# EAGLE design BigBoard (EAGLE 6.5.0)
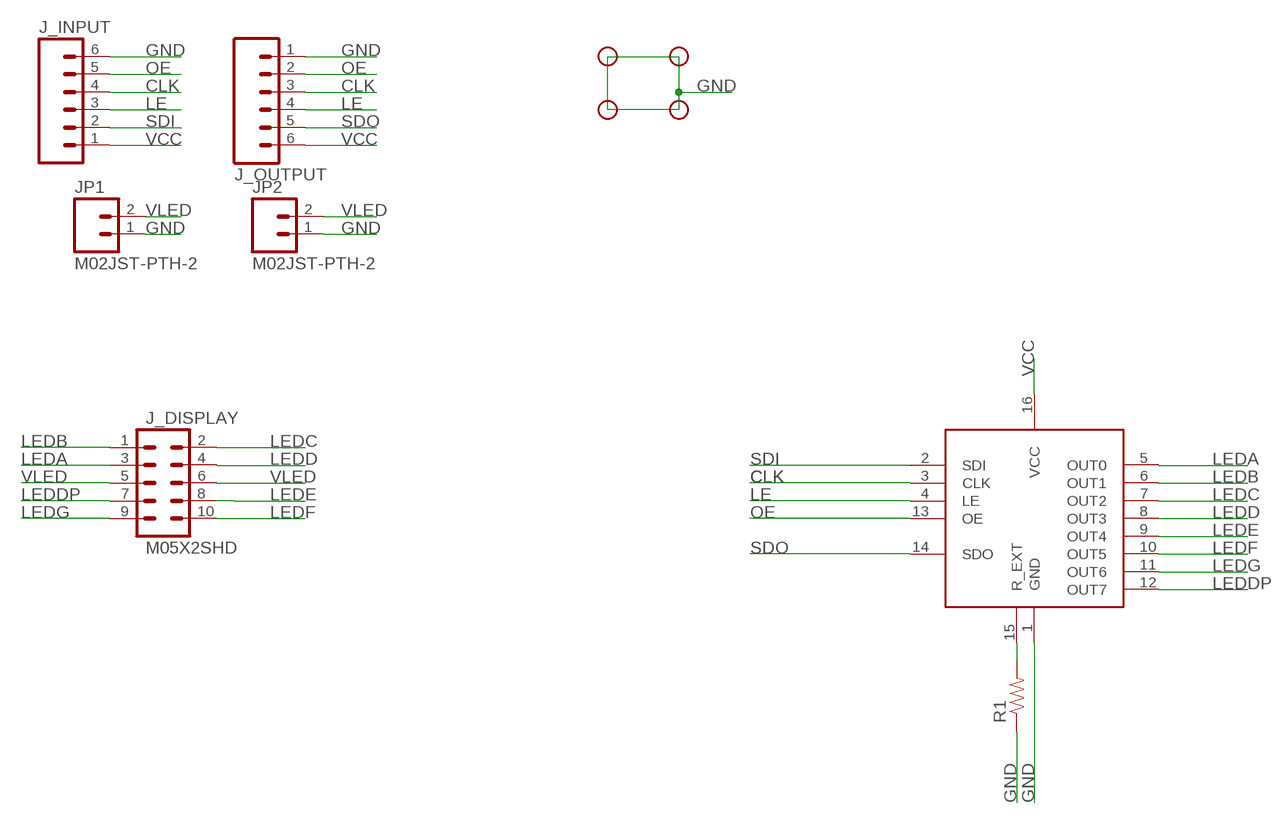
[diagram p0: schematic, sheet 1]

## Parts
J_DISPLAY  M05X2SHD  [2X5-SHROUDED]
J_INPUT  M06POLAR  [MOLEX-1X6]
J_OUTPUT  M06POLAR  [MOLEX-1X6]
JP1  M02JST-PTH-2  [JST-2-PTH]
JP2  M02JST-PTH-2  [JST-2-PTH]
R1  RESISTOR0603-RES  [0603-RES]
STANDOFF1  STAND-OFF  [STAND-OFF]
STANDOFF2  STAND-OFF  [STAND-OFF]
STANDOFF3  STAND-OFF  [STAND-OFF]
STANDOFF4  STAND-OFF  [STAND-OFF]
U$2  A6278EA  [A6278EA]

## Nets
CLK: J_INPUT.4 J_OUTPUT.3 U$2.3(CLK)
GND: J_INPUT.6 J_OUTPUT.1 JP1.1 JP2.1 R1.1 U$2.1(GND)
LE: J_INPUT.3 J_OUTPUT.4 U$2.4(LE)
LEDA: J_DISPLAY.3 U$2.5(OUT0)
LEDB: J_DISPLAY.1 U$2.6(OUT1)
LEDC: J_DISPLAY.2 U$2.7(OUT2)
LEDD: J_DISPLAY.4 U$2.8(OUT3)
LEDDP: J_DISPLAY.7 U$2.12(OUT7)
LEDE: J_DISPLAY.8 U$2.9(OUT4)
LEDF: J_DISPLAY.10 U$2.10(OUT5)
LEDG: J_DISPLAY.9 U$2.11(OUT6)
N$13: R1.2 U$2.15(R_EXT)
OE: J_INPUT.5 J_OUTPUT.2 U$2.13(OE)
SDI: J_INPUT.2 U$2.2(SDI)
SDO: J_OUTPUT.5 U$2.14(SDO)
VCC: J_INPUT.1 J_OUTPUT.6 U$2.16(VCC)
VLED: J_DISPLAY.5 J_DISPLAY.6 JP1.2 JP2.2

## Library data of the parts
J_DISPLAY = SparkFun-Connectors:M05X2: Header 5x2 Standard 10-pin dual row 0.1" header. Commonly used with AVR-ISP. Use with Spark Fun Electronics SKU: PRT-00778
J_INPUT J_OUTPUT = SparkFun-Connectors:M06: Header 6 Standard 6-pin 0.1" header. Use with straight break away headers (SKU : PRT-00116), right angle break away headers (PRT-00553), swiss pins (PRT-00743), machine pins (PRT-00117), and female headers (PRT-00115). Molex polarized connector foot print use with SKU : PRT-08094 with associated crimp pins and housings. NOTES ON THE VARIANTS LOCK and LOCK_LONGPADS... This footprint was designed to help hold the alignment of a through-hole component (i.e. 6-pin header) while soldering it into place. You may notice that each hole has been shifted either up or down by 0.005 of an inch from it's more standard position (which is a perfectly straight line). This slight alteration caused the pins (the squares in the middle) to touch the edges of the holes. Because they are alternating, it causes a "brace" to hold the component in place. 0.005 has proven to be the perfect amount of "off-center" position when using our standard breakaway headers. Although looks a little odd when you look at the bare footprint, once you have a header in there, the alteration is very hard to notice. Also,if you push a header all the way into place, it is covered up entirely on the bottom side. This idea of altering the position of holes to aid alignment will be further integrated into the Sparkfun Library for other footprints. It can help hold any component with 3 or more connection pins.
JP1 JP2 = SparkFun-Connectors:M02: Standard 2-pin 0.1" header. Use with - straight break away headers ( PRT-00116) - right angle break away headers (PRT-00553) - swiss pins (PRT-00743) - machine pins (PRT-00117) - female headers (PRT-00115) Molex polarized connector foot print use with: PRT-08233 with associated crimp pins and housings. 2.54_SCREWTERM for use with PRT-10571. 3.5mm Screw Terminal footprints for PRT-08084 5mm Screw Terminal footprints for use with PRT-08433; SKU: PRT-09914
R1 = SparkFun-Passives:RESISTOR: Resistor Basic schematic elements and footprints for 0603, 1206, and PTH resistors.
STANDOFF1-STANDOFF4 = SparkFun-Electromechanical:STAND-OFF: #4 Stand Off This is the mechanical footprint for a #4 phillips button head screw. Use the keepout ring to avoid running the screw head into surrounding components. SKU : PRT-00447
U$2 = bigboard:A6278EA

## Board
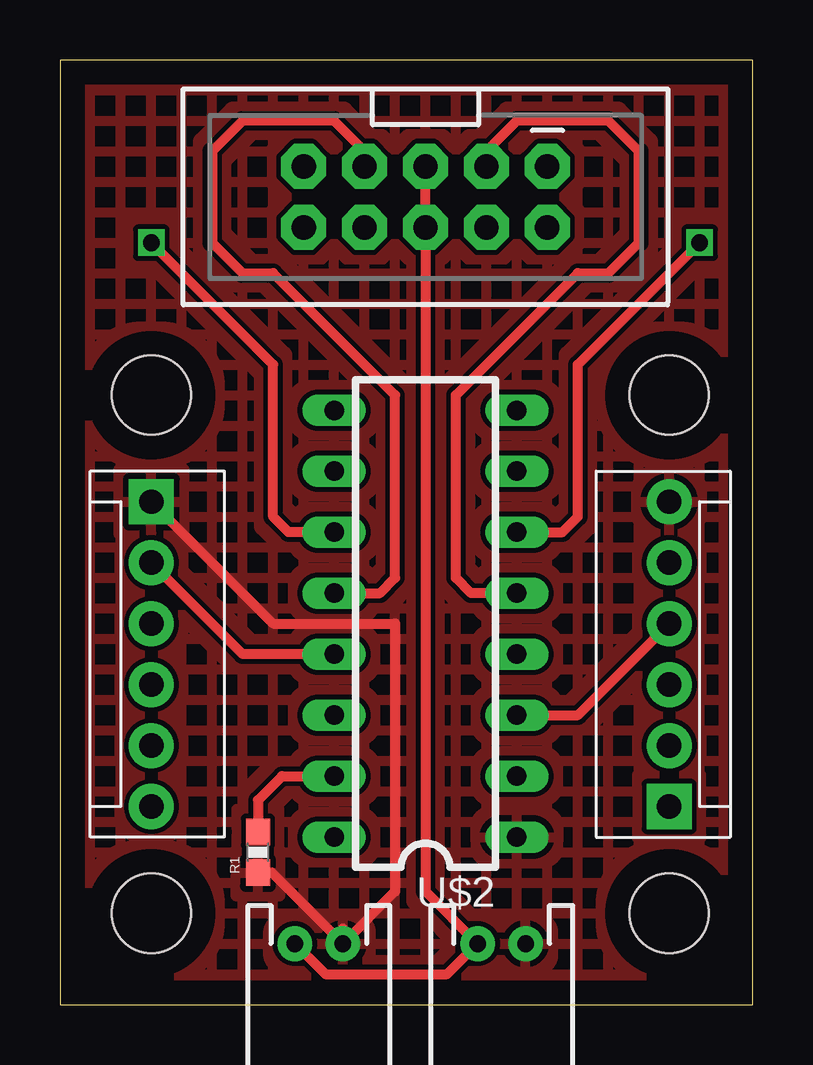
[diagram p1: board, top side]
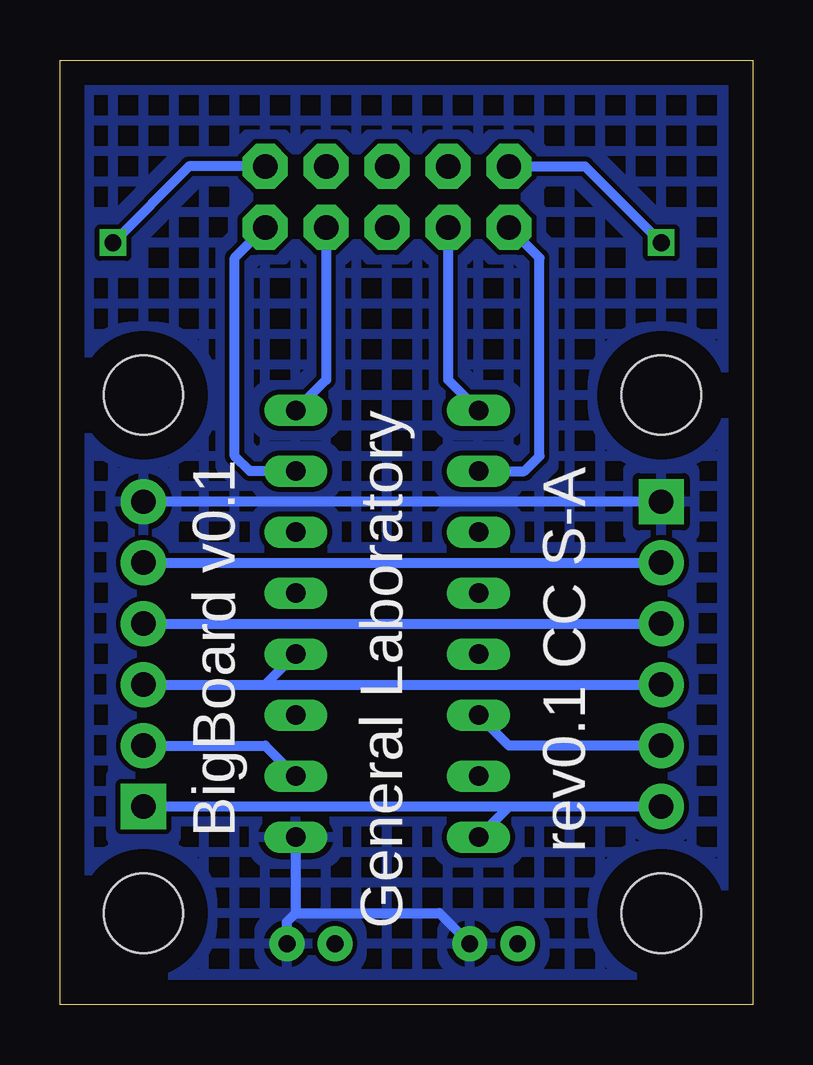
[diagram p2: board, bottom side, seen from below]

Size 28.88 x 39.36 mm. Coordinates in mm from the lower left corner, seen from the top.
Outline: 0,0 28.88,0 28.88,39.36 0,39.36 0,0
Copper layers (1*16): Top 0.035mm / dielectric 1.5mm / Bottom 0.035mm
Design rules "default": minimum track width 10mil, minimum drill 24mil, track to track 8mil, track to pad 8mil, pad to pad 8mil, via to via 8mil, smd to smd 8mil, copper to edge 40mil, drill to drill 8mil, minimum pad ring 10mil, minimum via ring 8mil, stop-mask expansion 4mil, vias tented up to drill 0mil, thermal gap 10mil

### Footprints (pad centres in the part's own frame; a part is rotated, then mirrored left to right if it is on the bottom)
2X5-SHROUDED = drill 1.016 pad 1.88 octagon: 1 -1.27,5.08; 2 1.27,5.08; 3 -1.27,2.54; 4 1.27,2.54; 5 -1.27,0; 6 1.27,0; 7 -1.27,-2.54; 8 1.27,-2.54; 9 -1.27,-5.08; 10 1.27,-5.08
MOLEX-1X6 = drill 1.016 pad 1.88 square: 1 0,0 | drill 1.016 pad 1.88: 2 2.54,0; 3 5.08,0; 4 7.62,0; 5 10.16,0; 6 12.7,0
JST-2-PTH = drill 0.7 pad 1.448: 1 -1,0; 2 1,0
0603-RES = smd 1.1 x 1: 1 -0.85,0; 2 0.85,0
STAND-OFF = hole 3.302: 0,0
A6278EA = drill 0.813 long: 1 -8.89,-3.81; 2 -6.35,-3.81; 3 -3.81,-3.81; 4 -1.27,-3.81; 5 1.27,-3.81; 6 3.81,-3.81; 7 6.35,-3.81; 8 8.89,-3.81; 9 8.89,3.81; 10 6.35,3.81; 11 3.81,3.81; 12 1.27,3.81; 13 -1.27,3.81; 14 -3.81,3.81; 15 -6.35,3.81; 16 -8.89,3.81

### Placement (x,y rotation side)
J_DISPLAY  15.24,33.66 270 top
J_INPUT  25.4,8.26 90 top
J_OUTPUT  3.81,20.95 270 top
JP1  10.79,2.54 180 top
JP2  18.41,2.54 180 top
R1  8.26,6.35 90 top
STANDOFF1  3.81,3.81 0 top
STANDOFF2  25.4,3.81 0 top
STANDOFF3  3.81,25.4 0 top
STANDOFF4  25.4,25.4 0 top
U$2  15.24,15.88 90 top

### Tracks (layer width: path | path; a pad name or v marks a point on that pad's centre or on a via)
CLK
  Top 0.406: U$2.3 21.59,12.06 J_INPUT.4
  Bottom 0.406: J_INPUT.4 J_OUTPUT.3
GND
  Top 0.406: JP1.1 11.79,3.18 | J_OUTPUT.1 8.89,15.88 13.97,15.88 13.97,4.71 JP1.1 | JP1.1 8.84,5.5 R1.1
  Bottom 0.406: J_OUTPUT.1 J_INPUT.6 | JP2.1 19.41,3.44 19.05,3.81 | 19.05,3.81 13.06,3.81 JP1.1 | U$2.1 19.05,3.81
  pour Bottom (hatched): -2.54,41.91 31.75,41.91 31.75,-2.54 -2.54,-2.54
  pour Top (hatched): -1.27,-1.27 30.48,-1.27 30.48,40.64 -1.27,40.64
LE
  Bottom 0.406: J_INPUT.3 20.32,13.34 | 20.32,13.34 J_OUTPUT.4 | U$2.4 20.32,13.34
LEDA
  Top 0.406: U$2.5 17.14,17.14 16.51,17.78 16.51,25.4 21.59,30.48 22.86,30.48 24.13,31.75 24.13,35.56 22.86,36.83 19.05,36.83 17.78,35.56 J_DISPLAY.3
LEDB  (via drill 0.7)
  Top 0.406: U$2.6 20.95,19.68 21.59,20.32 21.59,26.67 v26.67,31.75
  Bottom 0.406: J_DISPLAY.1 23.5,34.92 v26.67,31.75
LEDC
  Bottom 0.406: U$2.7 20.95,22.23 21.59,22.86 21.59,31.11 J_DISPLAY.2
LEDD
  Bottom 0.406: J_DISPLAY.4 17.78,26.04 U$2.8
LEDDP
  Top 0.406: J_DISPLAY.7 12.7,35.56 11.43,36.83 7.62,36.83 6.35,35.56 6.35,31.75 7.62,30.48 8.89,30.48 13.97,25.4 13.97,17.78 13.34,17.14 U$2.12
LEDE
  Bottom 0.406: J_DISPLAY.8 12.7,26.04 U$2.9
LEDF
  Bottom 0.406: U$2.10 9.53,22.23 8.89,22.86 8.89,31.11 J_DISPLAY.10
LEDG  (via drill 0.7)
  Top 0.406: U$2.11 9.53,19.68 8.89,20.32 8.89,26.67 v3.81,31.75
  Bottom 0.406: J_DISPLAY.9 6.99,34.92 v3.81,31.75
N$13
  Top 0.406: U$2.15 9.26,9.53 8.26,8.52 R1.2
OE
  Top 0.406: U$2.13 7.62,14.61 J_OUTPUT.2
  Bottom 0.406: J_INPUT.5 J_OUTPUT.2
SDI
  Bottom 0.406: J_INPUT.2 20.32,10.79 U$2.2
SDO
  Bottom 0.406: J_OUTPUT.5 10.16,10.79 U$2.14
VCC
  Bottom 0.406: J_OUTPUT.6 10.16,8.26 | 10.16,8.26 J_INPUT.1 | U$2.16 10.16,8.26
VLED
  Top 0.406: JP1.2 11.06,1.27 16.14,1.27 JP2.2 15.24,4.71 J_DISPLAY.6 J_DISPLAY.5

### Text on the board
_bsilk: BigBoard v0.1 | rev0.1 CC S-A | General Laboratory